# Altium project PCB_Project1.PrjPCB
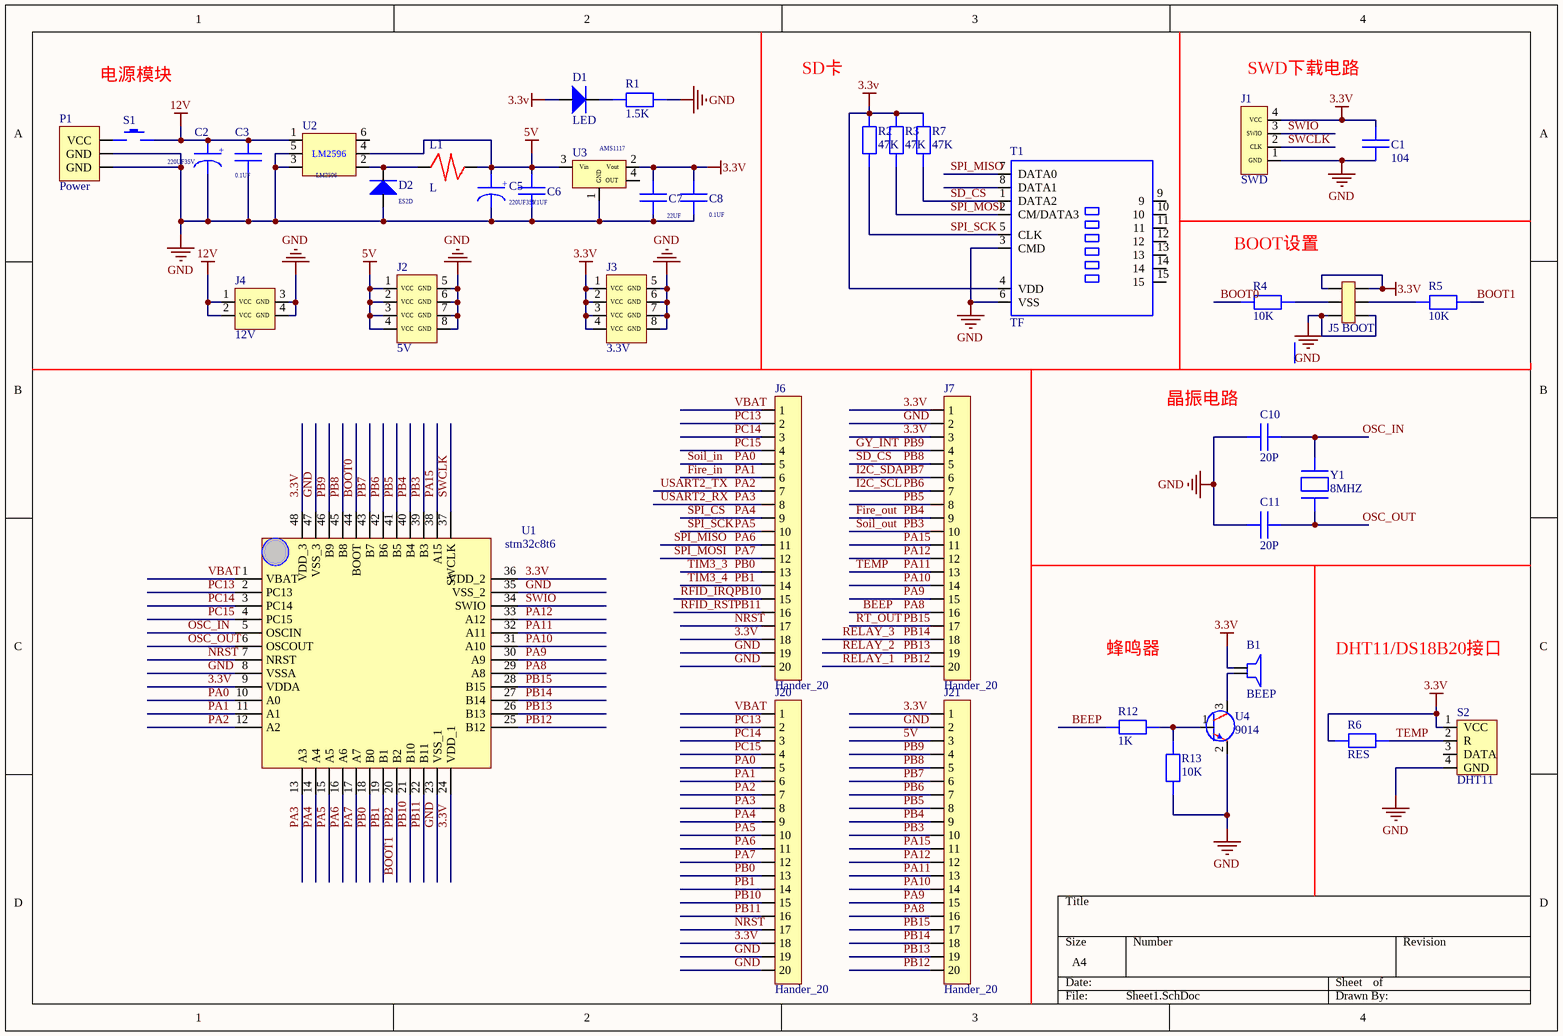
[diagram p0: Sheet1.SchDoc]
1 sheet, 40 parts. Net scope: global (net labels, ports and power ports of the same name join across sheets).
Board files: STM32C8T6.PcbDoc, PCB2.PcbDoc

## Sheet Sheet1.SchDoc
size A4

### Parts
B1  BEEP  [BEEP-9.5X5.5]
C1  104  [CAP_0603_FIRE]
C2  220UF35V  [CAP+_47UF_FIRE]
C3  0.1UF  [CAP_0603_FIRE]
C5  220UF35V  [CAP+_47UF_FIRE]
C6  0.1UF  [CAP_0603_FIRE]
C7  22UF  [CAP_0603_FIRE]
C8  0.1UF  [CAP_0603_FIRE]
C10  20P  [CAP_0603_FIRE]
C11  20P  [CAP_0603_FIRE]
D1  LED  [LED_Z]
D2  ES2D  [LED_Z]
J1  SWD  [SWD]
J2  5V  [5V]
J3  3.3V  [3.3V]
J4  12V  [12V]
J5  BOOT  [BOOT]
J6  Hander_20  [Hander_20]
J7  Hander_20  [Hander_20]
J20  Hander_20  [Hander_20]
J21  Hander_20  [Hander_20]
L1  L  [L]
P1  Power  [POWER]
R1  1.5K  [R_0603]
R2  47K  [R_0603]
R3  47K  [R_0603]
R4  10K  [R_0603]
R5  10K  [R_0603]
R6  RES  [R_0603]
R7  47K  [R_0603]
R12  1K  [R_0603]
R13  10K  [R_0603]
S1  (no value)  [SWITCH]
S2  DHT11  [DHT11]
T1  TF  [TF_CARD]
U1  stm32c8t6  [LQFP48_N]
U2  LM2596  [LM2596]
U3  AMS1117  [AMS-1117-3.3]
U4  9014  [SOT-23]
Y1  8MHZ  [XTAL_socket]

### Nets
3.3V: B1.1 C1.2 C7.2 C8.2 D1.1 J1.4(VCC) J3.1(VCC) J3.2(VCC) J3.3(VCC) J3.4(VCC) J5.1 J5.6 J6.18 J7.1 J7.3 J20.18 J21.1 R2.2 R3.2 R6.1 R7.2 S2.1(VCC) T1.4(VDD) U1.9(VDDA) U1.24(VDD_1) U1.36(VDD_2) U1.48(VDD_3) U3.2(Vout)
5V: C5.1 C6.1 J2.1(VCC) J2.2(VCC) J2.3(VCC) J2.4(VCC) J21.3 L1.2 U2.4 U3.3(Vin)
12V: C2.1 C3.2 J4.1(VCC) J4.2(VCC) S1.2(VCC) U2.1
GND: C1.1 C2.2 C3.1 C5.2 C6.2 C7.1 C8.1 C10.1 C11.1 D2.1 J1.1(GND) J2.5(GND) J2.6(GND) J2.7(GND) J2.8(GND) J3.5(GND) J3.6(GND) J3.7(GND) J3.8(GND) J4.3(GND) J4.4(GND) J5.3 J5.4 J6.19 J6.20 J7.2 J20.19 J20.20 J21.2 P1.1(GND) P1.2(GND) R1.2 R13.1 S2.4(GND) T1.3(CMD) T1.6(VSS) U1.8(VSSA) U1.23(VSS_1) U1.35(VSS_2) U1.47(VSS_3) U2.3 U2.5 U3.1(GND) U4.2
BEEP: J7.16 J21.16 R12.1 U1.29(A8)  [also labelled PA8]
BOOT0: R4.1 U1.44(BOOT)
BOOT1: R5.2 U1.20(B2)  [also labelled PB2]
Fire_in: J6.6 J20.6 U1.11(A1)  [also labelled PA1]
Fire_out: J7.9 J21.9 U1.40(B4)  [also labelled PB4]
GY_INT: J7.4 J21.4 U1.46(B9)  [also labelled PB9]
I2C_SCL: J7.7 J21.7 U1.42(B6)  [also labelled PB6]
I2C_SDA: J7.6 J21.6 U1.43(B7)  [also labelled PB7]
NRST: J6.17 J20.17 U1.7(NRST)
OSC_IN: C10.2 U1.5(OSCIN) Y1.2
OSC_OUT: C11.2 U1.6(OSCOUT) Y1.1
PA0: J6.5 J20.5 U1.10(A0)  [also labelled Soil_in]
PA2: J6.7 J20.7 U1.12(A2)  [also labelled USART2_TX]
PA3: J6.8 J20.8 U1.13(A3)  [also labelled USART2_RX]
PA4: J6.9 J20.9 U1.14(A4)  [also labelled SPI_CS]
PA5: J6.10 J20.10 R2.1 T1.5(CLK) U1.15(A5)  [also labelled SPI_SCK]
PA6: J6.11 J20.11 T1.7(DATA0) U1.16(A6)  [also labelled SPI_MISO]
PA7: J6.12 J20.12 R3.1 T1.2(CM/DATA3) U1.17(A7)  [also labelled SPI_MOSI]
PA9: J7.15 J21.15 U1.30(A9)
PA10: J7.14 J21.14 U1.31(A10)
PA11: J7.13 J21.13 R6.2 S2.2(R) U1.32(A11)  [also labelled TEMP]
PA12: J7.12 J21.12 U1.33(A12)
PA15: J7.11 J21.11 U1.38(A15)
PB0: J6.13 J20.13 U1.18(B0)  [also labelled TIM3_3]
PB1: J6.14 J20.14 U1.19(B1)  [also labelled TIM3_4]
PB3: J7.10 J21.10 U1.39(B3)  [also labelled Soil_out]
PB5: J7.8 J21.8 U1.41(B5)
PB8: J7.5 J21.5 R7.1 T1.1(DATA2) U1.45(B8)  [also labelled SD_CS]
PB10: J6.15 J20.15 U1.21(B10)  [also labelled RFID_IRQ]
PB11: J6.16 J20.16 U1.22(B11)  [also labelled RFID_RST]
PB12: J7.20 J21.20 U1.25(B12)  [also labelled RELAY_1]
PB13: J7.19 J21.19 U1.26(B13)  [also labelled RELAY_2]
PB14: J7.18 J21.18 U1.27(B14)  [also labelled RELAY_3]
PB15: J7.17 J21.17 U1.28(B15)  [also labelled RT_OUT]
PC13: J6.2 J20.2 U1.2(PC13)
PC14: J6.3 J20.3 U1.3(PC14)
PC15: J6.4 J20.4 U1.4(PC15)
SWCLK: J1.2(CLK) U1.37(SWCLK)
SWIO: J1.3(SWIO) U1.34(SWIO)
VBAT: J6.1 J20.1 U1.1(VBAT)
NetB1_2: B1.2 U4.3
NetD1_2: D1.2 R1.1
NetD2_2: D2.2 L1.1 U2.2
NetJ5_2: J5.2 R4.2
NetJ5_5: J5.5 R5.1
NetP1_3: P1.3(VCC) S1.1(VCC)
NetR12_2: R12.2 R13.2 U4.1

Not connected (* = marked no-connect by the designer): S2 3(DATA); T1 8(DATA1) 9 10 11 12 13 14 15; U2 6; U3 4(OUT)

### Notes on the sheet
- 电源模块
- SD卡
- (near J1) SWD下载电路
- BOOT设置
- 晶振电路
- 蜂鸣器
- DHT11/DS18B20接口
- (in symbol Capactiance+) +

### Library data of the parts
C1 C3 C6-C8 C10 C11 = Capacitance
C2 C5 = Capactiance+
D2 = LED
R1-R5 R7 R12 R13 = RES
S1 = Switch
Y1 = XTAL